# Altium schematic sheet Zasil.SchDoc
size A4
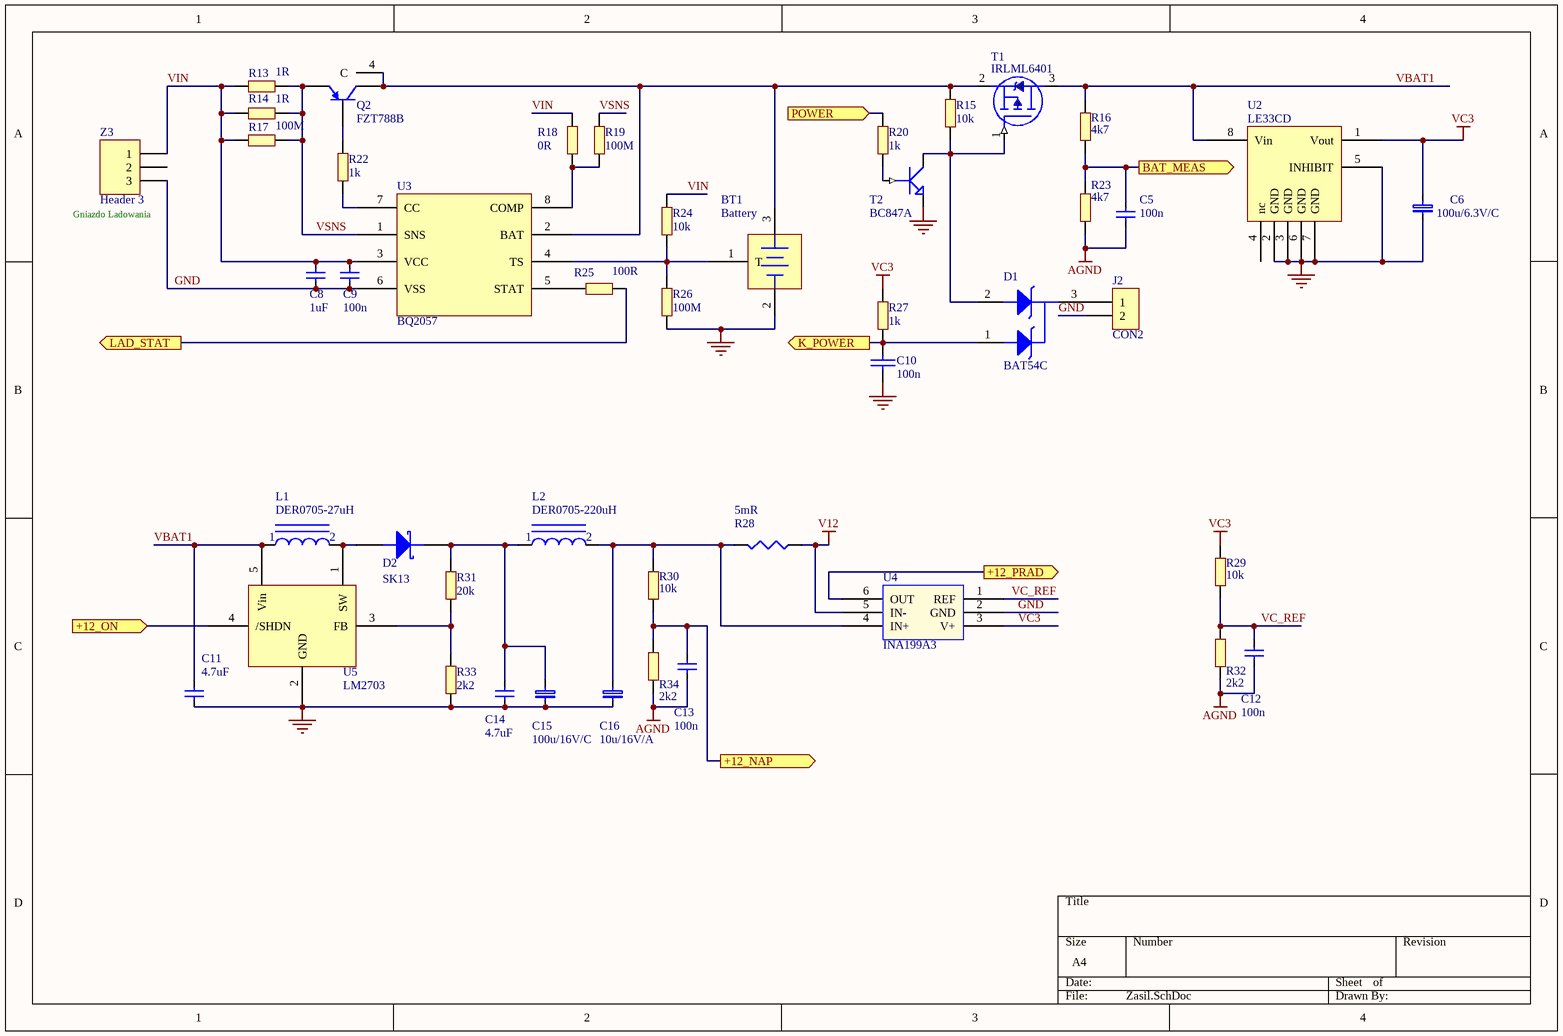
[diagram p0: Zasil.SchDoc]

## Parts
BT1  Battery  [BAT4]
C5  100n  [0603C]
C6  100u/6.3V/C  [CAP_C]
C8  1uF  [0603C]
C9  100n  [0603C]
C10  100n  [0603C]
C11  4.7uF  [1206]
C12  100n  [0603C]
C13  100n  [0603C]
C14  4.7uF  [1206]
C15  100u/16V/C  [CAP_C]
C16  10u/16V/A  [CAP_A]
D1  BAT54C  [SOT23]
D2  SK13  [RD5]
J2  CON2  [SIP2]
L1  DER0705-27uH  [DER0705]
L2  DER0705-220uH  [DER0705]
Q2  FZT788B  [MP04A_N1]
R13  1R  [0805R]
R14  1R  [0805R]
R15  10k  [0603R]
R16  4k7  [0603R]
R17  100M  [0805R]
R18  0R  [0603R]
R19  100M  [0603R]
R20  1k  [0603R]
R22  1k  [0603R]
R23  4k7  [0603R]
R24  10k  [0603R]
R25  100R  [0603R]
R26  100M  [0603R]
R27  1k  [0603R]
R28  5mR  [1206R]
R29  10k  [0603R]
R30  10k  [0603R]
R31  20k  [0603R]
R32  2k2  [0603R]
R33  2k2  [0603R]
R34  2k2  [0603R]
T1  IRLML6401  [SOT23]
T2  BC847A  [SOT23]
U2  LE33CD  [SO8]
U3  BQ2057  [SO8]
U4  INA199A3  [SC70-6]
U5  LM2703  [SOT23-5]
Z3  Header 3  [PIN3_2.5]

## Ports
+12_NAP (out), +12_ON (in), +12_PRAD (out), BAT_MEAS (out), K_POWER (out), LAD_STAT (out), POWER (in)

## Nets
AGND: C5.2 C12.2 C13.2 R23.1 R32.1 R34.1
GND: BT1.2(-) C6.1 C8.2 C9.2 C10.2 C11.2 C14.2 C15.1 C16.1 J2.2 R26.2 R33.2 T2.2(E) U2.2(GND) U2.3(GND) U2.5(INHIBIT) U2.6(GND) U2.7(GND) U3.6(VSS) U4.2(GND) U5.2(GND) Z3.3
V12: R28.1 U4.5(IN-)
VC3: C6.2 R27.2 R29.2 U2.1(Vout) U4.3(V+)
+12_NAP: C13.1 R30.1 R34.2 ; port +12_NAP
+12_ON: U5.4(/SHDN) ; port +12_ON
+12_PRAD: U4.6(OUT) ; port +12_PRAD
BAT_MEAS: C5.1 R16.1 R23.2 ; port BAT_MEAS
K_POWER: C10.1 D1.1(A1) R27.1 ; port K_POWER
LAD_STAT: R25.2 ; port LAD_STAT
POWER: R20.2 ; port POWER
VBAT1: C11.1 L1.1 R16.2 T1.3(DRAIN) U2.8(Vin) U5.5(Vin)
VC_REF: C12.1 R29.1 R32.2 U4.1(REF)
VIN: C8.1 C9.1 R13.1 R14.1 R17.1 R18.1 R24.1 U3.3(VCC) Z3.1
VSNS: Q2.3(E) R13.2 R14.2 R17.2 R19.1 U3.1(SNS)
NetBT1_1: BT1.1(T) R24.2 R26.1 U3.4(TS)
NetBT1_3: BT1.3(+) Q2.2(C) Q2.4(C) R15.2 T1.2(SOURCE) U3.2(BAT)
NetC14_1: C14.1 C15.2 D2.K L2.1 R31.1
NetC16_2: C16.2 L2.2 R28.2 R30.2 U4.4(IN+)
NetD1_2: D1.2(A2) R15.1 T1.1(GATE) T2.3(C)
NetD1_3: D1.3(K) J2.1
NetD2_A: D2.A L1.2 U5.1(SW)
NetQ2_1: Q2.1(B) R22.1
NetR18_2: R18.2 R19.2 U3.8(COMP)
NetR20_1: R20.1 T2.1(B)
NetR22_2: R22.2 U3.7(CC)
NetR25_1: R25.1 U3.5(STAT)
NetR31_2: R31.2 R33.1 U5.3(FB)

Not connected (* = marked no-connect by the designer): U2 4(nc); Z3 2

## Notes on the sheet
- (near Z3) Gniazdo Ladowania

## Library data of the parts
BT1 = BAT_TEL: Multicell Battery; Published: *; LatestRevisionDate: *; LatestRevisionNote: *; PackageReference: *; Publisher: *
C5 C8 C9 C11-C14 = CAP
C6 C15 C16 = CAP_TANTAL_SMD: KONDENSATOR ELEKTROLITYCZNY TANTALOWY SMD
C10 = CAP: Capacitor
D2 = DIODE SCHOTTKY: Schottky Diode
J2 = CON2: Connector
L1 L2 = CEWKA_1
Q2 = PNP: Published: 8-Jun-2000; LatestRevisionDate: 29-May-2009; LatestRevisionNote: IPC-7351 Footprint Added.; PackageVersion: Aug-1999; PackageReference: SOT-23B; Publisher: Altium Limited; PackageDescription: 3-Pin SOT-23 Package 0.95 mm Pitch, 2.4 mm Lead Span
R13-R20 R22-R27 R29-R34 = RES3
R28 = RES1: Dostawca.Symbol: WW12RR005FTL; Dostawca: TME
T1 = IRLML9303: Low Charge N-Channel MOSFET
T2 = BC847A: NPN Transistor
U2 = LE33
U4 = INA199: Dostawca.Symbol: INA199A3DCKT; Dostawca: TME
Z3 = Header 3: Header, 3-Pin; LatestRevisionDate: 17-Jul-2002; LatestRevisionNote: Re-released for DXP Platform.; Publisher: Altium Limited